# EAGLE schematic e6_esp12ebreakoutv1 (EAGLE 7.3.0)
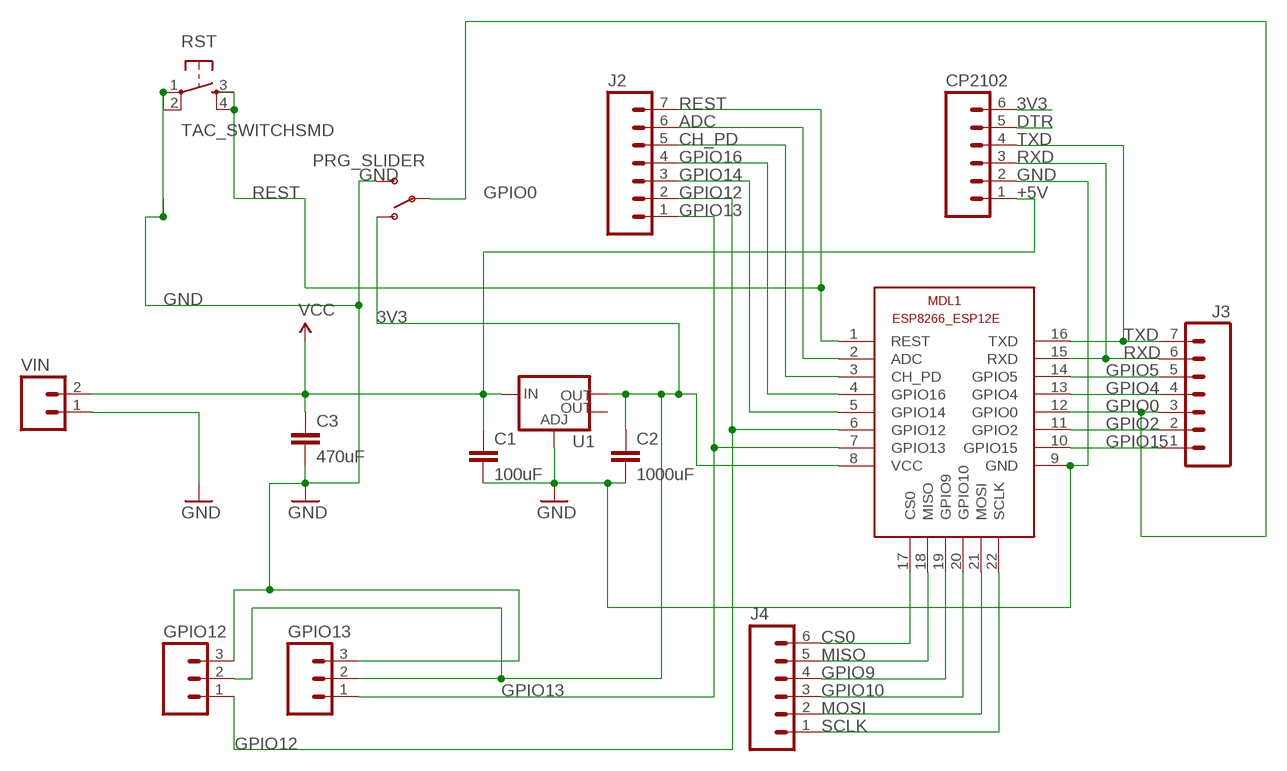
[diagram p0: schematic, sheet 1]

## Parts
C1  100uF  CAPSMD  [GRM43D]
C2  1000uF  CAPSMD  [GRM43D]
C3  470uF  CAPSMD  [GRM43D]
CP2102  M06LOCK  [1X06_LOCK]
GPIO12  M03LOCK  [1X03_LOCK]
GPIO13  M03LOCK  [1X03_LOCK]
J2  M07  [1X07]
J3  M07  [1X07]
J4  M06LOCK  [1X06_LOCK]
MDL1  ESP8266-12EESP8266-ESP12E  [ESP8266-ESP12E]
PRG_SLIDER  SWITCH-SPDT-SMD-A  [SWITCH-SPST-SMD-A]
RST  TAC_SWITCHSMD  [TACTILE-SWITCH-SMD]
U1  V_REG_LM1117SOT223  [SOT223]
VIN  M02PTH3  [1X02_LONGPADS]

## Nets
3V3: C2.A CP2102.6 GPIO12.2 GPIO13.2 MDL1.8(VCC) PRG_SLIDER.1(O) U1.2(OUT)
+5V: C1.A C3.A CP2102.1 U1.3(IN) VIN.2 ; supply symbol labelled VCC
ADC: J2.6 MDL1.2(ADC)
CH_PD: J2.5 MDL1.3(CH_PD)
CS0: J4.6 MDL1.17(CS0)
DTR: CP2102.5
GND: C1.C C2.C C3.C CP2102.2 GPIO12.3 GPIO13.3 MDL1.9(GND) PRG_SLIDER.3(S) RST.1 RST.2 U1.1(ADJ) VIN.1
GPIO0: J3.3 MDL1.12(GPIO0) PRG_SLIDER.2(P)
GPIO2: J3.2 MDL1.11(GPIO2)
GPIO4: J3.4 MDL1.13(GPIO4)
GPIO5: J3.5 MDL1.14(GPIO5)
GPIO9: J4.4 MDL1.19(GPIO9)
GPIO10: J4.3 MDL1.20(GPIO10)
GPIO12: GPIO12.1 J2.2 MDL1.6(GPIO12)
GPIO13: GPIO13.1 J2.1 MDL1.7(GPIO13)
GPIO14: J2.3 MDL1.5(GPIO14)
GPIO15: J3.1 MDL1.10(GPIO15)
GPIO16: J2.4 MDL1.4(GPIO16)
MISO: J4.5 MDL1.18(MISO)
MOSI: J4.2 MDL1.21(MOSI)
REST: J2.7 MDL1.1(REST) RST.4
RXD: CP2102.3 J3.6 MDL1.15(RXD)
SCLK: J4.1 MDL1.22(SCLK)
TXD: CP2102.4 J3.7 MDL1.16(TXD)
Unconnected: RST.3 U1.4(OUT)

## Library data of the parts
C1-C3 = SparkFun-Capacitors:CAP: Capacitor Standard 0603 ceramic capacitor, and 0.1" leaded capacitor.
CP2102 J4 = SparkFun-Connectors:M06: Header 6 Standard 6-pin 0.1" header. Use with straight break away headers (SKU : PRT-00116), right angle break away headers (PRT-00553), swiss pins (PRT-00743), machine pins (PRT-00117), and female headers (PRT-00115). Molex polarized connector foot print use with SKU : PRT-08094 with associated crimp pins and housings. NOTES ON THE VARIANTS LOCK and LOCK_LONGPADS... This footprint was designed to help hold the alignment of a through-hole component (i.e. 6-pin header) while soldering it into place. You may notice that each hole has been shifted either up or down by 0.005 of an inch from it's more standard position (which is a perfectly straight line). This slight alteration caused the pins (the squares in the middle) to touch the edges of the holes. Because they are alternating, it causes a "brace" to hold the component in place. 0.005 has proven to be the perfect amount of "off-center" position when using our standard breakaway headers. Although looks a little odd when you look at the bare footprint, once you have a header in there, the alteration is very hard to notice. Also,if you push a header all the way into place, it is covered up entirely on the bottom side. This idea of altering the position of holes to aid alignment will be further integrated into the Sparkfun Library for other footprints. It can help hold any component with 3 or more connection pins.
GPIO12 GPIO13 = SparkFun-Connectors:M03: Header 3 Standard 3-pin 0.1" header. Use with straight break away headers (SKU : PRT-00116), right angle break away headers (PRT-00553), swiss pins (PRT-00743), machine pins (PRT-00117), and female headers (PRT-00115). Molex polarized connector foot print use with SKU : PRT-08232 with associated crimp pins and housings.
J2 J3 = SparkFun-Connectors:M07: Header 7 Standard 7-pin 0.1" header. Use with straight break away headers (SKU : PRT-00116), right angle break away headers (PRT-00553), swiss pins (PRT-00743), machine pins (PRT-00117), and female headers (PRT-00115). NOTES ON THE VARIANTS LOCK and LOCK_LONGPADS... This footprint was designed to help hold the alignment of a through-hole component (i.e. 7-pin header) while soldering it into place. You may notice that each hole has been shifted either up or down by 0.005 of an inch from it's more standard position (which is usually a perfectly straight line). This slight alteration caused the pins (the squares in the middle) to touch the edges of the holes. Because they are alternating, it causes a "brace" to hold the header in place. 0.005 has proven to be the perfect amount of "off-center" position when using our standard breakaway headers. Although looks a little odd when you look at the bare footprint, once you have a header in there, the alteration is very hard to notice. Also, if you push a header all the way into place, it is covered up entirely on the bottom side. This idea of altering the position of holes to aid alignment will be further integrated into the Sparkfun Library for other footprints. It can help hold any component with 3 or more connection pins.
MDL1 = ESP8266-ESP12E:ESP8266-12E: ESP8266-12E with additional I/O and GPIO04/05 corrected The author cannot warrant that this library is free from error or will meet your specific requirements. Created by PuceBaboon.com. Komagane, Nagano, JAPAN
PRG_SLIDER = SparkFun-Electromechanical:SWITCH-SPDT: SPDT Switch Simple slide switch, Spark Fun Electronics SKU : COM-00102 DPDT SMT slide switch, AYZ0202, SWCH-08179; PROD_ID: SWCH-10651
RST = SparkFun-Retired:TAC_SWITCH: Momentary Switch Button commonly used for reset or general input. Spark Fun Electronics SKU : COM-00097 SMT- SWCH-08247; PROD_ID: SWCH-08247
U1 = SparkFun-PowerIC:V_REG_LM1117: Voltage Regulator LM1117 Standard adjustable voltage regulator but in SMD form. Spark Fun Electronics SKU : COM-00595; PROD_ID: VREG-08170
VIN = SparkFun-Connectors:M02: Standard 2-pin 0.1" header. Use with - straight break away headers ( PRT-00116) - right angle break away headers (PRT-00553) - swiss pins (PRT-00743) - machine pins (PRT-00117) - female headers (PRT-00115) Molex polarized connector foot print use with: PRT-08233 with associated crimp pins and housings. 2.54_SCREWTERM for use with PRT-10571. 3.5mm Screw Terminal footprints for PRT-08084 5mm Screw Terminal footprints for use with PRT-08432